# EAGLE design speaker (EAGLE 9.6.2)
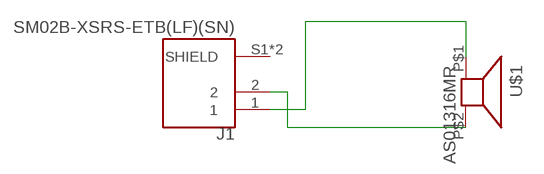
[diagram p0: schematic, sheet 1]

## Parts
J1  SM02B-XSRS-ETB(LF)(SN)  [JST_SM02B-XSRS-ETB(LF)(SN)]
U$1  AS01316MR  [AS01316MR]

## Nets
N$1: J1.2 U$1.P$2
N$2: J1.1 U$1.P$1
Unconnected: J1.S1(SHIELD) J1.S2(SHIELD)

## Library data of the parts
J1 = open_earphones:SM02B-XSRS-ETB(LF)(SN): CONN HEADER SMD R/A 2POS 0.6MM; MANUFACTURER: JST; STANDARD: Manufacturer Recommendations
U$1 = open_earphones:AS01316MR

## Board
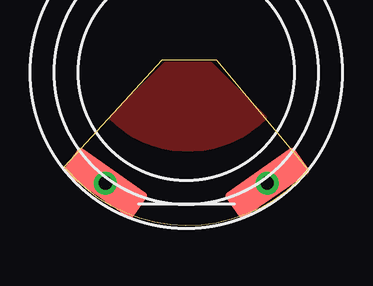
[diagram p1: board, top side]
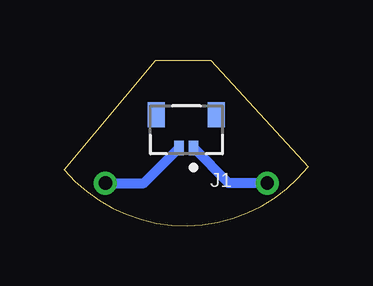
[diagram p2: board, bottom side, seen from below]

Size 10.16 x 6.9 mm. Coordinates in mm from the lower left corner, seen from the top.
Outline: 10.16,2.33 arc-101 0,2.46 4.06,6.9 6.35,6.9 10.16,2.33
Copper layers (1*16): Top 0.035mm / dielectric 0.73mm / Bottom 0.035mm
Design rules "default *": minimum track width 6mil, minimum drill 0.35mm, track to track 6mil, track to pad 6mil, pad to pad 6mil, via to via 6mil, smd to smd 6mil, copper to edge 0mil, drill to drill 6mil, minimum pad ring 10mil, minimum via ring 8mil, stop-mask expansion 0mil, vias tented up to drill 0mil, thermal gap 10mil

### Footprints (pad centres in the part's own frame; a part is rotated, then mirrored left to right if it is on the bottom)
JST_SM02B-XSRS-ETB(LF)(SN) = smd 0.4 x 0.6: 1 -0.3,1.375; 2 0.3,1.375 | smd 0.7 x 1.05: S1 -1.25,0; S2 1.25,0
AS01316MR = smd 3.5 x 1.27 rotated 145: P$1 -3.37,-4.62 | smd 3.5 x 1.27 rotated 215: P$2 3.37,-4.62

### Placement (x,y rotation side)
J1  5.08,4.62 180 bottom
U$1  5.08,6.4 0 top

### Tracks (layer width: path | path; a pad name or v marks a point on that pad's centre or on a via)
N$1  (via drill 0.55)
  Bottom 0.406: U$1.P$2 6.85,1.78 J1.2
  other vias: 8.45,1.78
N$2  (via drill 0.55)
  Bottom 0.406: U$1.P$1 3.31,1.78 J1.1
  other vias: 1.71,1.78
T
  pour Top: 1.91,4.49 4.19,6.78 6.1,6.78 8.38,4.49 arc-90